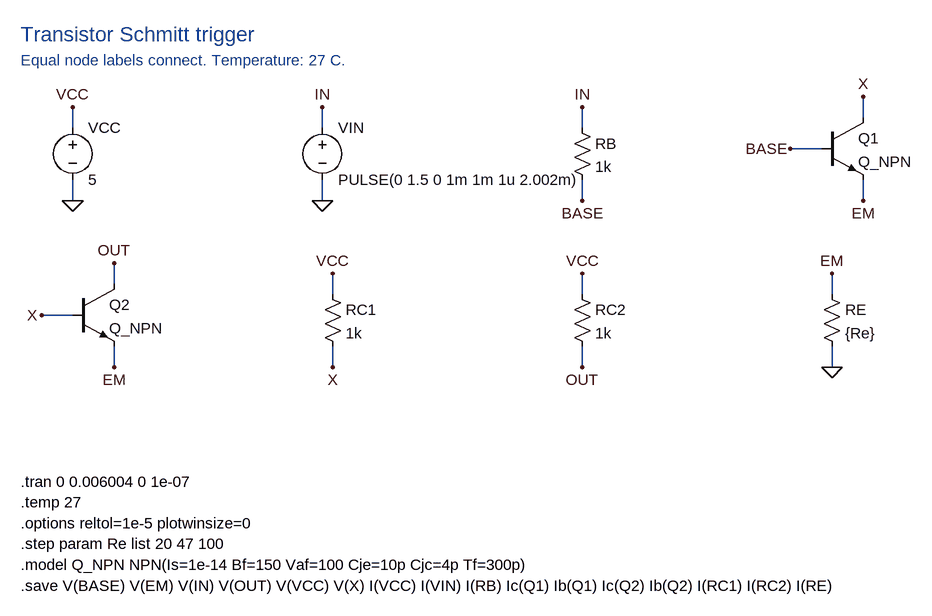
[diagram p0: schematic transistor-schmitt-trigger.asc]
transistor-schmitt-trigger.asc, the LTspice schematic file:
Version 4
SHEET 1 1740 1032
WIRE 144 176 144 144
WIRE 144 256 144 288
WIRE 528 176 528 144
WIRE 528 256 528 288
WIRE 928 176 928 144
WIRE 928 256 928 288
WIRE 1360 160 1360 128
WIRE 1296 208 1248 208
WIRE 1360 256 1360 288
WIRE 208 416 208 384
WIRE 144 464 96 464
WIRE 208 512 208 544
WIRE 544 432 544 400
WIRE 544 512 544 544
WIRE 928 432 928 400
WIRE 928 512 928 544
WIRE 1312 432 1312 400
WIRE 1312 512 1312 544
FLAG 144 144 VCC
FLAG 144 288 0
FLAG 528 144 IN
FLAG 528 288 0
FLAG 928 144 IN
FLAG 928 288 BASE
FLAG 1360 128 X
FLAG 1248 208 BASE
FLAG 1360 288 EM
FLAG 208 384 OUT
FLAG 96 464 X
FLAG 208 544 EM
FLAG 544 400 VCC
FLAG 544 544 X
FLAG 928 400 VCC
FLAG 928 544 OUT
FLAG 1312 400 EM
FLAG 1312 544 0
SYMBOL voltage 144 160 R0
SYMATTR InstName VCC
SYMATTR Value 5
SYMBOL voltage 528 160 R0
SYMATTR InstName VIN
SYMATTR Value PULSE(0 1.5 0 1m 1m 1u 2.002m)
SYMBOL res 912 160 R0
SYMATTR InstName RB
SYMATTR Value 1k
SYMBOL npn 1296 160 R0
SYMATTR InstName Q1
SYMATTR Value Q_NPN
SYMBOL npn 144 416 R0
SYMATTR InstName Q2
SYMATTR Value Q_NPN
SYMBOL res 528 416 R0
SYMATTR InstName RC1
SYMATTR Value 1k
SYMBOL res 912 416 R0
SYMATTR InstName RC2
SYMATTR Value 1k
SYMBOL res 1296 416 R0
SYMATTR InstName RE
SYMATTR Value {Re}
TEXT 64 32 Left 3 ;Transistor Schmitt trigger
TEXT 64 72 Left 2 ;Equal node labels connect. Temperature: 27 C.
TEXT 64 720 Left 2 !.tran 0 0.006004 0 1e-07
TEXT 64 752 Left 2 !.temp 27
TEXT 64 784 Left 2 !.options reltol=1e-5 plotwinsize=0
TEXT 64 816 Left 2 !.step param Re list 20 47 100
TEXT 64 848 Left 2 !.model Q_NPN NPN(Is=1e-14 Bf=150 Vaf=100 Cje=10p Cjc=4p Tf=300p)
TEXT 64 880 Left 2 !.save V(BASE) V(EM) V(IN) V(OUT) V(VCC) V(X) I(VCC) I(VIN) I(RB) Ic(Q1) Ib(Q1) Ic(Q2) Ib(Q2) I(RC1) I(RC2) I(RE)

The netlist it stands for:
* transistor-schmitt-trigger.asc
VCC VCC 0 5
VIN IN 0 PULSE(0 1.5 0 1m 1m 1u 2.002m)
RB IN BASE 1k
Q1 X BASE EM 0 Q_NPN
Q2 OUT X EM 0 Q_NPN
RC1 VCC X 1k
RC2 VCC OUT 1k
RE EM 0 {Re}
.model NPN NPN
.model PNP PNP
.lib standard.bjt
* Transistor Schmitt trigger
* Equal node labels connect. Temperature: 27 C.
.tran 0 0.006004 0 1e-07
.temp 27
.options reltol=1e-5 plotwinsize=0
.step param Re list 20 47 100
.model Q_NPN NPN(Is=1e-14 Bf=150 Vaf=100 Cje=10p Cjc=4p Tf=300p)
.save V(BASE) V(EM) V(IN) V(OUT) V(VCC) V(X) I(VCC) I(VIN) I(RB) Ic(Q1) Ib(Q1) Ic(Q2) Ib(Q2) I(RC1) I(RC2) I(RE)
.backanno
.end